# Altium schematic sheet MAIN.SchDoc
size 431 x 279 mm; SheetNumber: 1; SheetTotal: 1
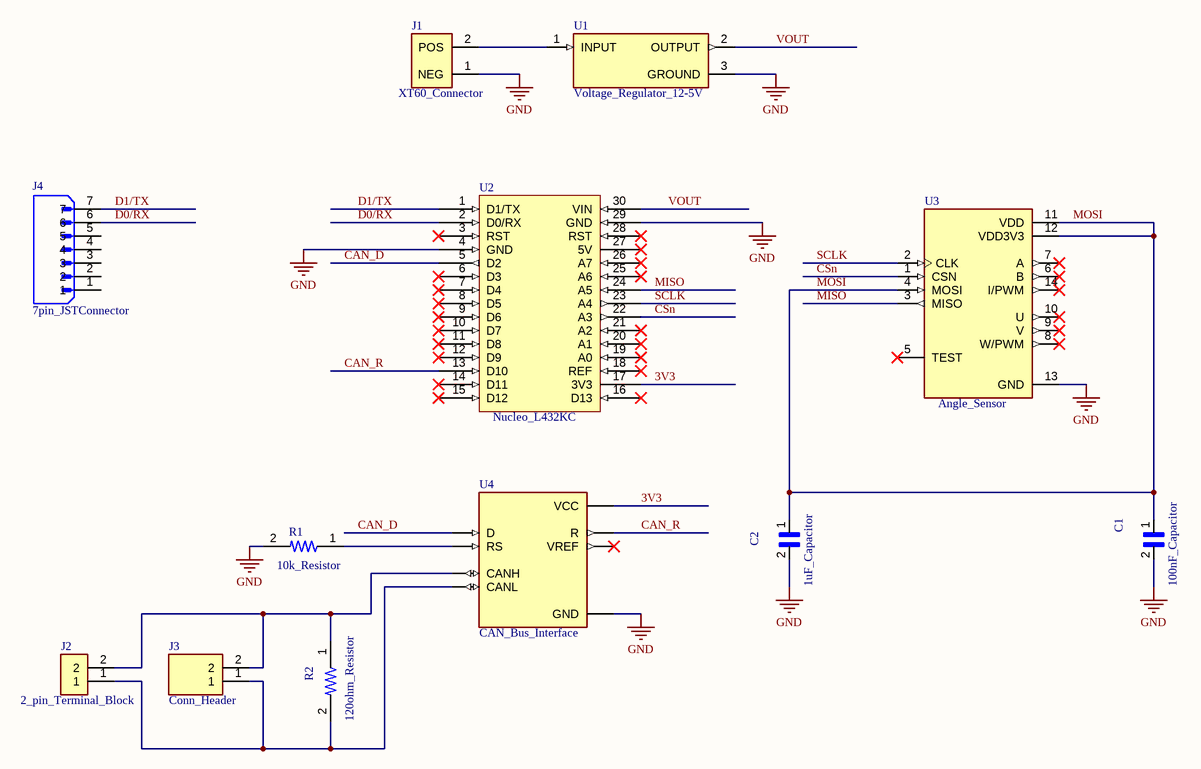
[diagram p0: MAIN.SchDoc]

## Parts
C1  100nF_Capacitor  [100nF_Capacitor]
C2  1uF_Capacitor  [1uF_Capacitor]
J1  XT60_Connector  [XT60_Connector]
J2  2_pin_Terminal_Block  [Terminal_Block]
J3  Conn_Header  [Conn_Header]
J4  7pin_JSTConnector  [7pin_JSTConnector]
R1  10k_Resistor  [10k_Resistor]
R2  120ohm_Resistor  [120ohm_Resistor]
U1  Voltage_Regulator_12-5V  [Voltage_Regulator_12-5V]
U2  Nucleo_L432KC  [Nucleo_L432KC]
U3  Angle_Sensor  [Angle_Sensor_AS5047P]
U4  CAN_Bus_Interface  [CAN_Bus_Interface]

## Nets
GND: C1.2 C2.2 J1.1(NEG) R1.2 U1.3(GROUND) U2.4(GND) U2.29(GND) U3.13(GND) U4.2(GND)
3V3: U2.17(3V3) U4.3(VCC)
CAN_D: U2.5(D2) U4.1(D)
CAN_R: U2.13(D10) U4.4(R)
CSn: U2.22(A3) U3.1(CSN)
D0/RX: J4.6 U2.2(D0/RX)
D1/TX: J4.7 U2.1(D1/TX)
MISO: U2.24(A5) U3.3(MISO)
MOSI: C1.1 C2.1 U3.4(MOSI) U3.11(VDD) U3.12(VDD3V3)
SCLK: U2.23(A4) U3.2(CLK)
VOUT: U1.2(OUTPUT) U2.30(VIN)
NetJ1_2: J1.2(POS) U1.1(INPUT)
NetJ2_1: J2.1 J3.1 R2.2 U4.6(CANL)
NetJ2_2: J2.2 J3.2 R2.1 U4.7(CANH)
NetR1_1: R1.1 U4.8(RS)

Not connected (* = marked no-connect by the designer): J4 1 2 3 4 5; U2 3(RST)* 6(D3)* 7(D4)* 8(D5)* 9(D6)* 10(D7)* 11(D8)* 12(D9)* 14(D11)* 15(D12)* 16(D13)* 18(REF)* 19(A0)* 20(A1)* 21(A2)* 25(A6)* 26(A7)* 27(5V)* 28(RST)*; U3 5(TEST)* 6(B)* 7(A)* 8(W/PWM)* 9(V)* 10(U)* 14(I/PWM)*; U4 5(VREF)*

## Notes on the sheet
- DWG. NO.
- REV.
- SHT.
- THIS DOCUMENT AND THE DATA DISCLOSED HEREIN OR HEREWITH IS THE PROPERTY OF ALTIUM LIMITED AND MAY BE FREELY DISTRIBUTED IN WHOLE. NO RIGHTS ARE RESERVED OR EXPRESS OR IMPLIED WARANTEE GIVEN.
- REVISION
- DESCRIPTION
- DATE
- APPROVED
- ENG:
- APPROVALS
- PROJECT
- DSN:
- CHK:
- REFERENCE DOCUMENTS
- PROJECT REVISION:
- TITLE
- DOCUMENT REVISION:
- DESIGN ITEM:
- BOM:
- FAB DWG:
- PCB DWG:
- ASSY DWG:
- SCALE:
- SIZE
- B
- CAGE CODE
- FILE NAME
- DWG NO.
- SHEET
- OF
- REV

## Library data of the parts
C1 = 100nF_Capacitor: Multilayer Ceramic Capacitors MLCC - SMD/SMT 100nF 25volts 10%; Manufacturer: Vishay Vitramon; Manufacturer Part Number: VJ0603Y104KLXAC5G; Dielectric: X7R; Voltage Rating (DC): 25V; Supplier 1: Mouser; Supplier Part Number 1: 77-VJ0603Y104KLXAC5G; RoHS: No; Category: Uncategorized; Stock 1: 2692; Pricing 1: 1=0.84000, 10=0.71000, 50=0.71000, 100=0.58000, 1000=0.46400, 10000=0.44600 (USD); Case/Package: 0603; Case Code (Imperial): 0603; Case Code (Metric): 1608; Weight: 7.1E-05oz; Min Operating Temperature: -55°C; Max Operating Temperature: 125°C; Packaging: Tape and Reel; Tolerance: 10%; Capacitance: 100nF; Package Quantity: 4000; Termination: SMD/SMT; Series: VJ HI-REL; Length: 1.6mm; Width: 0.8mm; Height: 0.92mm; RoHS Compliant: No; ComponentLink1URL: https://datasheet.ciiva.com/13401/highrels-223441-13401989.pdf?src-supplier=Mouser; ComponentLink1Description: https://datasheet.ciiva.com/13401/highrels-223441-13401989.pdf?src-supplier=Mouser
C2 = 1uF_Capacitor: Multilayer Ceramic Capacitors MLCC - SMD/SMT 1uF 50V 0603 RoHS; Manufacturer: Yageo; Manufacturer Part Number: CC0603KRX5R9BB105; Tolerance: 10%; Dielectric: X5R; Supplier 1: Arrow Electronics; Supplier Part Number 1: CC0603KRX5R9BB105; RoHS: Yes; Category: Ceramic Capacitors; Stock 1: 2780; Pricing 1: 1=0.28140, 10=0.19610, 25=0.19410, 100=0.16370, 250=0.16210, 500=0.09730, 1000=0.06680 (USD); Mount: Surface Mount; Case/Package: 0603; Case Code (Metric): 1608; Case Code (Imperial): 0603; Weight: 7.1E-05oz; Min Operating Temperature: -55°C; Max Operating Temperature: 85°C; Packaging: Tape and Reel; Capacitance: 1uF; Voltage Rating: 50V; Termination: SMD/SMT; Resistor Type: Ceramic; Voltage Rating (DC): 50V; Package Quantity: 4000; Length: 0.063inch; Width: 0.031inch; Thickness: 0.035inch; Lead Free: Lead Free; Halogen Free: Halogen Free; RoHS Compliant: Yes; ComponentLink1URL: http://www.mouser.com/ds/2/447/Yageo_UPY-GP_NP0_16V-to-50V_9-358835.pdf?src-supplier=Mouser; ComponentLink1Description: http://www.mouser.com/ds/2/447/Yageo_UPY-GP_NP0_16V-to-50V_9-358835.pdf?src-supplier=Mouser; ComponentLink2URL: http://www.yageo.com/documents/recent/UPY-GPHC_X5R_4V-to-50V_25.pdf?src-supplier=Digi-Key; ComponentLink2Description: http://www.yageo.com/documents/recent/UPY-GPHC_X5R_4V-to-50V_25.pdf?src-supplier=Digi-Key
J1 = XT60_Connector: 20.5x8.1mm 铜镀金 DC500V 30A; Manufacturer: Amass; Manufacturer Part Number: XT60-M; Supplier 1: TME; Supplier Part Number 1: XT60-M; RoHS: No; Stock 1: 14568; Pricing 1: 1=0.58000, 20=0.50000, 100=0.44000, 500=0.39000 (EUR)
J2 = 2_pin_Terminal_Block: Connector, Terminal Block; Wire Receptacle; 2 Pos.; 16-30 AWG; 0.2 in. CL; Side;; Manufacturer: TE Connectivity; Manufacturer Part Number: 282837-2; Plating: Brass; Number of Levels: 1; Number of Positions Per Level: 2; Current: 13.5A; Voltage: 300V; Closed End: No (Without); Interlock: Yes (With); Voltage Rating: 250V; Gender: Female; Pitch: 5.08mm; Wire Gauge (Max): 16AWG; Wire Gauge (Min): 30AWG; Tail Length: 3.5mm; Thread Size: M3; Approvals: UL; Supplier 1: Arrow Electronics; Supplier Part Number 1: 282837-2; RoHS: Yes; Category: Terminal Blocks; Stock 1: 1; Pricing 1: 1=0.60770, 10=0.37930, 25=0.37550, 50=0.37180, 100=0.33170, 250=0.33070, 500=0.31670, 1000=0.26460, 5000=0.23620 (USD); Mount: Through Hole; Color: Green; Contact Plating: Tin; Housing Color: Green; Housing Material: Polyamide; Contact Material: Brass; Weight: 0.059966oz; Termination: Solder; Packaging: Bulk; Number of Contacts: 2; Orientation: Straight; Number of Rows: 1; Package Quantity: 300; Number of Positions: 2; Number of Circuits: 2; Current Rating: 13.5A; Screw Flange: No (Without); Screwless Terminal Block: No (Without); Side Stackable: Yes (With); Max Current Rating: 13.5A; Connector Type: Receptacle; Max Voltage Rating (AC): 250V; Max Supply Voltage (AC): 250V; Voltage Rating (AC): 250V; Number of Poles: 2; Length: 10.76mm; Width: 11.5mm; Height: 11.5mm; Depth: 8.2mm; Wire/Cable Gauge: 30AWG; Radiation Hardening: No; Flammability Rating: UL94 V-0; RoHS Compliant: Yes; ELV: Compliant; Lead Free: Lead Free; REACH SVHC: Unknown; ComponentLink1URL: https://datasheet.ciiva.com/819/eng-cs-1308389-eurostyle-terminal-blocks-0607-819104.pdf?src-supplier=Avnet; ComponentLink1Description: https://datasheet.ciiva.com/819/eng-cs-1308389-eurostyle-terminal-blocks-0607-819104.pdf?src-supplier=Avnet; ComponentLink2URL: https://datasheet.ciiva.com/16305/eng-cs-1308389-eurostyle-terminal-blocks-0607-16305248.pdf?src-supplier=Future+Electronics; ComponentLink2Description: https://datasheet.ciiva.com/16305/eng-cs-1308389-eurostyle-terminal-blocks-0607-16305248.pdf?src-supplier=Future+Electronics; ComponentLink3URL: https://datasheet.ciiva.com/19467/750688-19467564.pdf?src-supplier=Jameco; ComponentLink3Description: https://datasheet.ciiva.com/19467/750688-19467564.pdf?src-supplier=Jameco; ComponentLink4URL: https://datasheet.ciiva.com/11758/0900766b80e7dc97-11758677.pdf?src-supplier=RSComponents; ComponentLink4Description: https://datasheet.ciiva.com/11758/0900766b80e7dc97-11758677.pdf?src-supplier=RSComponents; ComponentLink5URL: https://datasheet.ciiva.com/14606/70086281-14606908.pdf?src-supplier=Allied+Electronics; ComponentLink5Description: https://datasheet.ciiva.com/14606/70086281-14606908.pdf?src-supplier=Allied+Electronics; ComponentLink6URL: https://datasheet.ciiva.com/18620/eng-cd-282837-g3-18620917.pdf?src-supplier=Digi-Key; ComponentLink6Description: https://datasheet.ciiva.com/18620/eng-cd-282837-g3-18620917.pdf?src-supplier=Digi-Key; ComponentLink7URL: https://datasheet.ciiva.com/823/eng-cd-282837-g3-823439.pdf?src-supplier=Digi-Key; ComponentLink7Description: https://datasheet.ciiva.com/823/eng-cd-282837-g3-823439.pdf?src-supplier=Digi-Key; ComponentLink8URL: https://datasheet.ciiva.com/7978/1650926-7978569.pdf?src-supplier=Element14; ComponentLink8Description: https://datasheet.ciiva.com/7978/1650926-7978569.pdf?src-supplier=Element14; ComponentLink9URL: https://datasheet.ciiva.com/30084/eng-cs-1308389-eurostyle-terminal-blocks-0607-30084269.pdf?src-supplier=Onlinecomponents.com; ComponentLink9Description: https://datasheet.ciiva.com/30084/eng-cs-1308389-eurostyle-terminal-blocks-0607-30084269.pdf?src-supplier=Onlinecomponents.com
J3 = Conn_Header: Conn Unshrouded Header HDR 2 POS 2.54mm Solder ST Thru-Hole Automotive Carton; Manufacturer: TE Connectivity; Manufacturer Part Number: 826629-2; Supplier 1: Arrow Electronics; Supplier Part Number 1: 826629-2; RoHS: Yes; Category: Headers and Wire Housings; Stock 1: 29511; Pricing 1: 1=0.28240, 10=0.25810, 100=0.23030, 500=0.21410, 1000=0.17470 (USD); RoHS Compliant: Yes; ComponentLink1URL: https://www.te.com/commerce/DocumentDelivery/DDEController?Action=srchrtrv&amp;DocNm=826629&amp;DocType=Customer+Drawing&amp;DocLang=English&src-supplier=Digi-Key; ComponentLink1Description: https://www.te.com/commerce/DocumentDelivery/DDEController?Action=srchrtrv&amp;DocNm=826629&amp;DocType=Customer+Drawing&amp;DocLang=English&src-supplier=Digi-Key
J4 = 7pin_JSTConnector: Connector Header, XH Series, 7 Position, 2.50mm, Through Hole, Press-Fit, Solder, Natural; Manufacturer: JST; Manufacturer Part Number: B7B-XH-A(LF)(SN); Current Rating: 3A; Number of Positions: 7; Contact Resistance: 20mR; Voltage Rating (AC): 250V; Insulation Resistance: 1GR; Pitch: 2.5mm; Wire/Cable Gauge: 22AWG; Supplier 1: Arrow Electronics; Supplier Part Number 1: B7B-XH-A(LF)(SN); RoHS: Yes; Category: Headers and Wire Housings; Stock 1: 3231; Pricing 1: 1=0.34920, 10=0.30050, 25=0.29750, 50=0.29450, 100=0.23390, 500=0.13360 (USD); Mount: Through Hole; Contact Plating: Copper,Tin,Lead; Contact Material: Brass; Color: Natural; Housing Color: White; Housing Material: Polyamide; Contact Shape: Square; Insulation Material: Nylon; Insulation Color: Natural; Contact Finish - Mating: TIN; Min Operating Temperature: -25°C; Max Operating Temperature: 85°C; Number of Rows: 1; Packaging: Bulk; Termination: Solder; Connector Type: Header; Series: XH; Contact Type: Male Pin; Voltage Rating: 250V; Max Current Rating: 3A; Fastening Type: Detent; Number of Contacts: 7; Max Voltage Rating (AC): 250V; Orientation: Straight; Length: 19.9mm; Lead Pitch: 2.5mm; Depth: 5.75mm; REACH SVHC: No SVHC; Lead Free: Lead Free; Flammability Rating: UL94 V-0; ComponentLink1URL: https://datasheet.ciiva.com/26894/getdatasheetpartid-440406-26894811.pdf?src-supplier=Verical; ComponentLink1Description: https://datasheet.ciiva.com/26894/getdatasheetpartid-440406-26894811.pdf?src-supplier=Verical; ComponentLink2URL: https://datasheet.ciiva.com/11747/0900766b80826551-11747681.pdf?src-supplier=RSComponents; ComponentLink2Description: https://datasheet.ciiva.com/11747/0900766b80826551-11747681.pdf?src-supplier=RSComponents
R1 = 10k_Resistor: Res Thin Film 0603 10K Ohm 0.1% 0.167W ±25ppm/C Epoxy Pad SMD T/R; Manufacturer: TE Connectivity; Manufacturer Part Number: RP73PF1J10KBTDF; Resistance: 10kR; Power Rating: 166mW; Max Power Dissipation: 167mW; Temperature Coefficient: 25ppm/°C; Voltage Rating: 100V; Supplier 1: Arrow Electronics; Supplier Part Number 1: RP73PF1J10KBTDF; RoHS: Yes; Category: Chip SMD Resistors; Stock 1: 5000; Pricing 1: 1000=0.17420, 2000=0.16290 (USD); Case/Package: 0603; Case Code (Imperial): 0603; Case Code (Metric): 1608; Min Operating Temperature: -55°C; Max Operating Temperature: 155°C; Packaging: Tape and Reel; Tolerance: 0.1%; Resistor Type: Thin Film; Package Quantity: 1000; Series: RP73P, Holsworthy; Number of Terminations: 2; Technology: THIN FILM; Termination: Flat; Construction: Rectangular; Resistance Tolerance: 0.1%; Length: 1.55mm; Width: 0.031inch; Height: 0.022inch; Depth: 0.8mm; Radiation Hardening: No; Military Standard: Not; REACH SVHC: No SVHC; RoHS Compliant: Yes; ComponentLink1URL: https://datasheet.ciiva.com/2546/eng-cd-1625867-ba-2546174.pdf?src-supplier=Digi-Key; ComponentLink1Description: https://datasheet.ciiva.com/2546/eng-cd-1625867-ba-2546174.pdf?src-supplier=Digi-Key
R2 = 120ohm_Resistor: Res Thick Film 0603 120 Ohm 1% 1/10W ±100ppm/°C Molded SMD SMD Paper T/R; Manufacturer: Yageo; Manufacturer Part Number: RC0603FR-10120RL; Resistance: 120R; Power Rating: 100mW; Voltage Rating: 50V; Supplier 1: Digi-Key; Supplier Part Number 1: 13-RC0603FR-10120RLCT-ND; RoHS: Yes; Category: Chip SMD Resistors; Stock 1: 93117; Pricing 1: 1=0.10000, 10=0.02300, 100=0.00930, 1000=0.00417, 2500=0.00362, 5000=0.00299 (USD); Case/Package: 0603; Contact Plating: Tin,Matte; Case Code (Imperial): 0603; Case Code (Metric): 1608; Min Operating Temperature: -55°C; Max Operating Temperature: 155°C; Tolerance: 1%; Resistor Type: Thick Film; Temperature Coefficient: 100ppm/°C; Packaging: Tape and Reel; Termination: SMD/SMT; Series: RC; Construction: Rectangular; Length: 1.6mm; Width: 0.8mm; Height: 0.45mm; Depth: 0.8mm; Radiation Hardening: No; Military Standard: Not; RoHS Compliant: Yes; ComponentLink1URL: https://datasheet.ciiva.com/12561/rc0603-272842-12561679.pdf?src-supplier=Mouser; ComponentLink1Description: https://datasheet.ciiva.com/12561/rc0603-272842-12561679.pdf?src-supplier=Mouser
U1 = Voltage_Regulator_12-5V: IC REG LDO 5V 1.5A DPAK; Manufacturer: STMicroelectronics; Manufacturer Part Number: L7805CDT-TR; Number of Outputs: 1; Max Input Voltage: 35V; Polarity: Positive; Quiescent Current: 8mA; Output Type: Fixed; Dropout Voltage: 2V; Min Input Voltage: 7V; Power Supply Rejection Ratio (PSRR): 62dB; Supplier 1: Arrow Electronics; Supplier Part Number 1: L7805CDT-TR; RoHS: Yes; Category: Voltage Regulators - Linear; Stock 1: 15; Pricing 1: 1=0.85320, 10=0.71710, 25=0.71000, 100=0.54440, 250=0.53900 (USD); Mount: Surface Mount; Case/Package: TO-252; Number of Pins: 3; Contact Plating: Tin,Matte; Min Operating Temperature: 0°C; Max Operating Temperature: 125°C; Max Output Current: 1.5A; Output Voltage: 5V; Package Quantity: 1; Packaging: Tape and Reel; Output Current: 1.5A; Number of Regulators: 1; Min Output Voltage: 5V; Series: -; Length: 6.6mm; Width: 6.2mm; Height: 2.4mm; Radiation Hardening: No; Lead Free: Lead Free; RoHS Compliant: Yes; ComponentLink1URL: https://datasheet.ciiva.com/2042/cd00000444-2042784.pdf?src-supplier=Digi-Key; ComponentLink1Description: https://datasheet.ciiva.com/2042/cd00000444-2042784.pdf?src-supplier=Digi-Key; ComponentLink2URL: https://datasheet.ciiva.com/2042/cd00000444-2042783.pdf?src-supplier=Digi-Key; ComponentLink2Description: https://datasheet.ciiva.com/2042/cd00000444-2042783.pdf?src-supplier=Digi-Key; ComponentLink3URL: https://datasheet.ciiva.com/2042/cd00000444-2042785.pdf?src-supplier=Digi-Key; ComponentLink3Description: https://datasheet.ciiva.com/2042/cd00000444-2042785.pdf?src-supplier=Digi-Key; ComponentLink4URL: https://datasheet.ciiva.com/4882/cd00000444-4882231.pdf?src-supplier=Mouser; ComponentLink4Description: https://datasheet.ciiva.com/4882/cd00000444-4882231.pdf?src-supplier=Mouser; ComponentLink5URL: https://datasheet.ciiva.com/16357/cd00000444-16357893.pdf?src-supplier=Future+Electronics; ComponentLink5Description: https://datasheet.ciiva.com/16357/cd00000444-16357893.pdf?src-supplier=Future+Electronics
U2 = Nucleo_L432KC: STM32 Nucleo-32 development board with STM32L432KC MCU, supports Arduino connectivity; Manufacturer: STMicroelectronics; Manufacturer Part Number: NUCLEO-L432KC; Evaluation Kit: Yes; Number of Bits: 32; Core Architecture: ARM; Supplier 1: RSComponents; Supplier Part Number 1: 1438574; RoHS: Yes; Category: Embedded Processors and Controllers; Stock 1: 874; Pricing 1: 1=9.90000 (GBP); REACH SVHC: No SVHC; Lead Free: Lead Free; ComponentLink1URL: http://www.farnell.com/datasheets/2064195.pdf?src-supplier=Farnell; ComponentLink1Description: http://www.farnell.com/datasheets/2064195.pdf?src-supplier=Farnell; ComponentLink2URL: http://www.st.com/content/ccc/resource/technical/document/data_brief/b1/d8/13/d4/b0/b7/4b/6e/DM00214578.pdf/files/DM00214578.pdf/jcr:content/translations/en.DM00214578.pdf?src-supplier=Digi-Key; ComponentLink2Description: http://www.st.com/content/ccc/resource/technical/document/data_brief/b1/d8/13/d4/b0/b7/4b/6e/DM00214578.pdf/files/DM00214578.pdf/jcr:content/translations/en.DM00214578.pdf?src-supplier=Digi-Key; ComponentLink3URL: http://www.farnell.com/datasheets/2064195.pdf?src-supplier=Element14; ComponentLink3Description: http://www.farnell.com/datasheets/2064195.pdf?src-supplier=Element14
U3 = Angle_Sensor: AS5047P Series 5.5 V 14-bit On-Axis Magnetic Rotary Position Sensor - TSSOP-14; Manufacturer: ams; Manufacturer Part Number: AS5047P-ATSM; Detent: No; Output Type: PWM; Supplier 1: RSComponents; Supplier Part Number 1: 2009463; RoHS: Yes; Category: Magnetic Sensors; Stock 1: 554; Pricing 1: 500=4.57300 (GBP); Mount: Surface Mount; Termination: SMD/SMT; Encoder Type: Magnetic; Built in Switch: No; Lead Free: Lead Free; RoHS Compliant: Yes; ComponentLink1URL: https://www.mouser.com/ds/2/588/AS5047P_DS000324_2-00-606067.pdf?src-supplier=Mouser; ComponentLink1Description: https://www.mouser.com/ds/2/588/AS5047P_DS000324_2-00-606067.pdf?src-supplier=Mouser; ComponentLink2URL: https://ams.com/documents/20143/36005/AS5047P_DS000324_2-00.pdf?src-supplier=Digi-Key; ComponentLink2Description: https://ams.com/documents/20143/36005/AS5047P_DS000324_2-00.pdf?src-supplier=Digi-Key; ComponentLink3URL: http://ams.com/eng/content/download/725051/1853902/379375?src-supplier=Digi-Key; ComponentLink3Description: http://ams.com/eng/content/download/725051/1853902/379375?src-supplier=Digi-Key
U4 = CAN_Bus_Interface: the sn65hvd230 sn65hvd231 and sn65hvd232 controller area network (can) transceivers are designed for use with the...; Manufacturer: Texas Instruments; Supplier 1: Win Source Electronics; Supplier Part Number 1: 670012-SN65HVD230; Manufacturer Part Number: SN65HVD230; RoHS: No; Stock 1: 299600; Pricing 1: 11=4.96000, 25=4.11400, 38=3.99300, 52=3.87200, 67=3.75100, 89=3.38800 (USD)